# Altium schematic sheet 10.LVDS.SchDoc
size A4
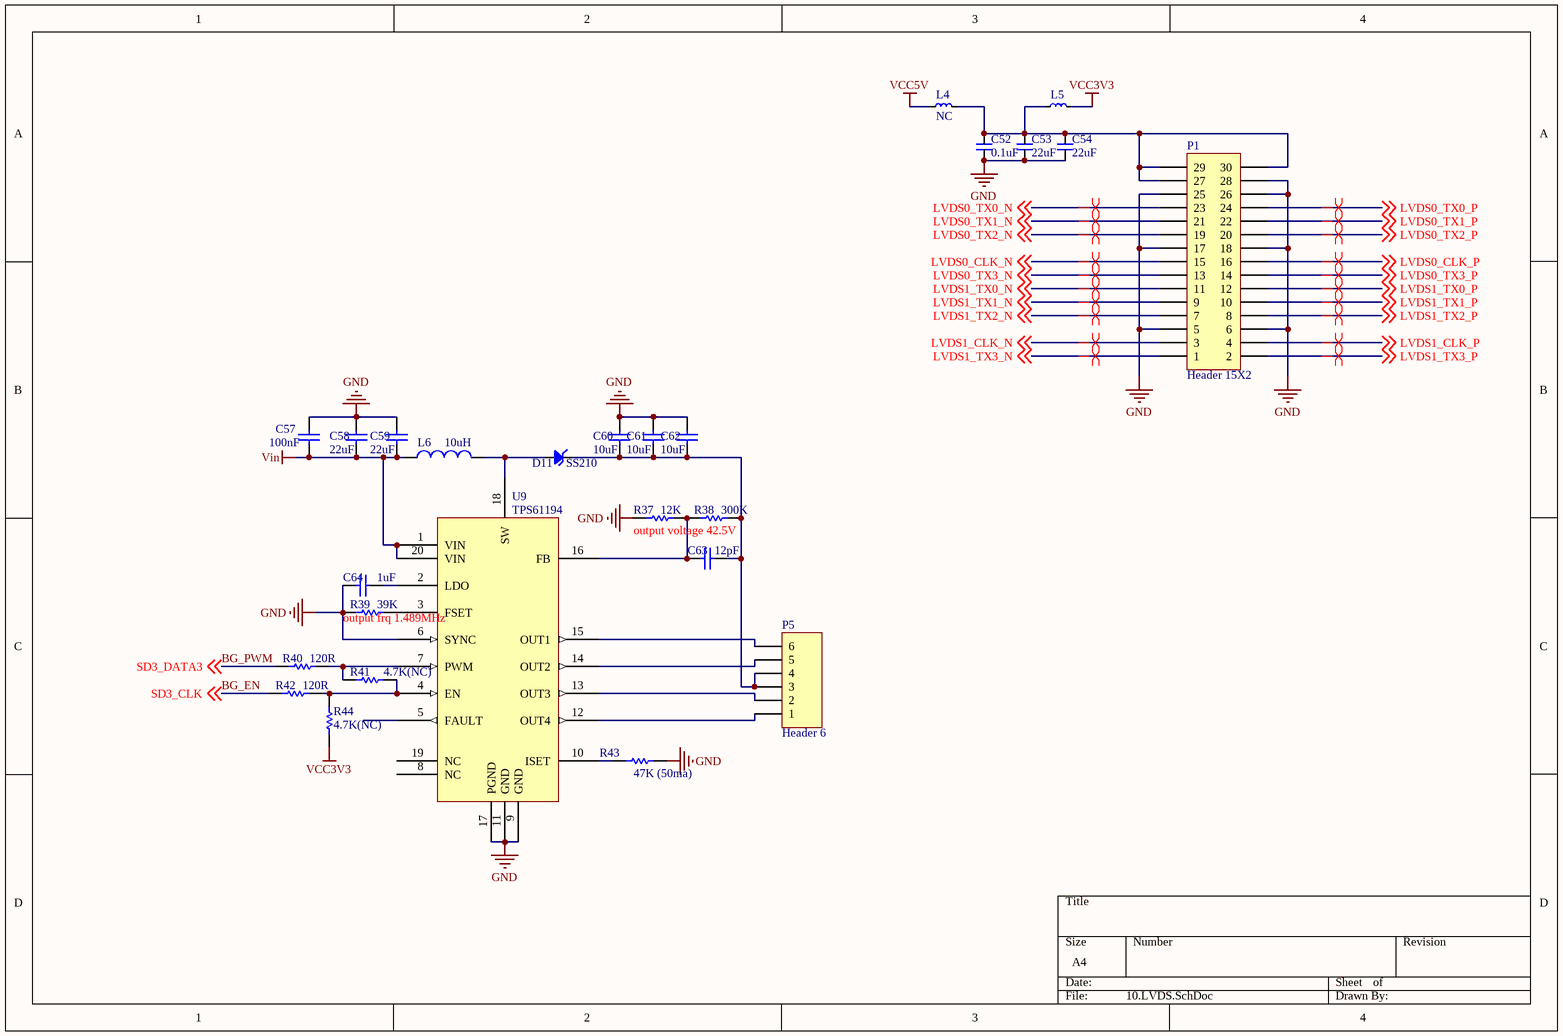
[diagram p0: 10.LVDS.SchDoc]

## Parts
C52  0.1uF  [0603C]
C53  22uF  [0603C]
C54  22uF  [0603C]
C57  value 100nF  [0603C]  (hidden comment: Cap)
C58  value 22uF  [C1206]  (hidden comment: Cap)
C59  value 22uF  [C1206]  (hidden comment: Cap)
C60  value 10uF  [C1206]  (hidden comment: Cap)
C61  value 10uF  [C1206]  (hidden comment: Cap)
C62  value 10uF  [C1206]  (hidden comment: Cap)
C63  value 12pF  [0603C]  (hidden comment: Cap)
C64  value 1uF  [0603C]  (hidden comment: Cap)
D11  SS210  [SMA]
L4  NC  [0805L]
L5  电感  [0805L]  (value not drawn)
L6  value 10uH  [L-6045]  (hidden comment: Inductor)
P1  Header 15X2  [2.0-15P*2]
P5  Header 6  [1.25mm-6P]
R37  value 12K  [0603R]  (hidden comment: Res1)
R38  value 300K  [0603R]  (hidden comment: Res1)
R39  value 39K  [0603R]  (hidden comment: Res1)
R40  value 120R  [0603R]  (hidden comment: Res1)
R41  value 4.7K(NC)  [0603R]  (hidden comment: Res1)
R42  value 120R  [0603R]  (hidden comment: Res1)
R43  value 47K (50ma)  [0603R]  (hidden comment: Res1)
R44  value 4.7K(NC)  [0603R]  (hidden comment: Res1)
U9  TPS61194  [HTTSOP-20]

## Nets
GND: C52.2 C53.1 C54.1 C57.2 C58.1 C59.1 C60.1 C61.1 C62.1 C64.1 P1.5 P1.6 P1.17 P1.18 P1.25 P1.26 P1.28 R37.1 R39.1 R43.2 U9.6(SYNC) U9.9(GND) U9.11(GND) U9.17(PGND) U9.21(PAD)
VCC3V3: L5.2 R44.2
VCC5V: L4.1
Vin: C57.1 C58.2 C59.2 L6.1 U9.1(VIN) U9.20(VIN)
BG_EN: R42.2 ; off-sheet SD3_CLK  [also labelled SD3_CLK]
BG_PWM: R40.2 ; off-sheet SD3_DATA3  [also labelled SD3_DATA3]
LVDS0_CLK_N: P1.15 ; off-sheet LVDS0_CLK_N
LVDS0_CLK_P: P1.16 ; off-sheet LVDS0_CLK_P
LVDS0_TX0_N: P1.23 ; off-sheet LVDS0_TX0_N
LVDS0_TX0_P: P1.24 ; off-sheet LVDS0_TX0_P
LVDS0_TX1_N: P1.21 ; off-sheet LVDS0_TX1_N
LVDS0_TX1_P: P1.22 ; off-sheet LVDS0_TX1_P
LVDS0_TX2_N: P1.19 ; off-sheet LVDS0_TX2_N
LVDS0_TX2_P: P1.20 ; off-sheet LVDS0_TX2_P
LVDS0_TX3_N: P1.13 ; off-sheet LVDS0_TX3_N
LVDS0_TX3_P: P1.14 ; off-sheet LVDS0_TX3_P
LVDS1_CLK_N: P1.3 ; off-sheet LVDS1_CLK_N
LVDS1_CLK_P: P1.4 ; off-sheet LVDS1_CLK_P
LVDS1_TX0_N: P1.11 ; off-sheet LVDS1_TX0_N
LVDS1_TX0_P: P1.12 ; off-sheet LVDS1_TX0_P
LVDS1_TX1_N: P1.9 ; off-sheet LVDS1_TX1_N
LVDS1_TX1_P: P1.10 ; off-sheet LVDS1_TX1_P
LVDS1_TX2_N: P1.7 ; off-sheet LVDS1_TX2_N
LVDS1_TX2_P: P1.8 ; off-sheet LVDS1_TX2_P
LVDS1_TX3_N: P1.1 ; off-sheet LVDS1_TX3_N
LVDS1_TX3_P: P1.2 ; off-sheet LVDS1_TX3_P
NetC52_1: C52.1 C53.2 C54.2 L4.2 L5.1 P1.27 P1.29 P1.30
NetC60_2: C60.2 C61.2 C62.2 C63.2 D11.K P5.3 P5.4 R38.2
NetC63_1: C63.1 R37.2 R38.1 U9.16(FB)
NetC64_2: C64.2 U9.2(LDO)
NetD11_A: D11.A L6.2 U9.18(SW)
NetP5_1: P5.1 U9.12(OUT4)
NetP5_2: P5.2 U9.13(OUT3)
NetP5_5: P5.5 U9.14(OUT2)
NetP5_6: P5.6 U9.15(OUT1)
NetR39_2: R39.2 U9.3(FSET)
NetR40_1: R40.1 R41.1 U9.7(PWM)
NetR41_2: R41.2 R42.1 R44.1 U9.4(EN)
NetR43_1: R43.1 U9.10(ISET)

Not connected (* = marked no-connect by the designer): U9 5(FAULT) 8(NC) 19(NC)

## Layout directives
differential pair: LVDS0_CLK_N, LVDS0_CLK_P, LVDS0_TX0_N, LVDS0_TX0_P, LVDS0_TX1_N, LVDS0_TX1_P, LVDS0_TX2_N, LVDS0_TX2_P, LVDS0_TX3_N, LVDS0_TX3_P, LVDS1_CLK_N, LVDS1_CLK_P, LVDS1_TX0_N, LVDS1_TX0_P, LVDS1_TX1_N, LVDS1_TX1_P, LVDS1_TX2_N, LVDS1_TX2_P, LVDS1_TX3_N, LVDS1_TX3_P

## Notes on the sheet
- output voltage 42.5V
- output frq 1.489MHz

## Library data of the parts
C52-C54 = 电容
C57-C64 = Cap: Capacitor; Published: 8-Jun-2000; LatestRevisionDate: 17-Jul-2002; LatestRevisionNote: Re-released for DXP Platform.; PackageReference: RAD-0.3; Publisher: Altium Limited
D11 = SS24: DIODES: *
L4 = 电感
L6 = Inductor: Code_IEC: 1005; Published: 8-Jun-2000; LatestRevisionDate: 17-Jul-2002; LatestRevisionNote: Re-released for DXP Platform.; PackageReference: 0402-A; Publisher: Altium Limited; Code_JEITA: 0402
P1 = Header 15X2: Header, 15-Pin, Dual row; LatestRevisionDate: 17-Jul-2002; LatestRevisionNote: Re-released for DXP Platform.; Publisher: Altium Limited
P5 = Header 6: Header, 6-Pin; LatestRevisionDate: 17-Jul-2002; LatestRevisionNote: Re-released for DXP Platform.; Publisher: Altium Limited
R37-R44 = Res1: Resistor; Published: 8-Jun-2000; LatestRevisionDate: 17-Jul-2002; LatestRevisionNote: Re-released for DXP Platform.; PackageReference: AXIAL-0.3; Publisher: Altium Limited